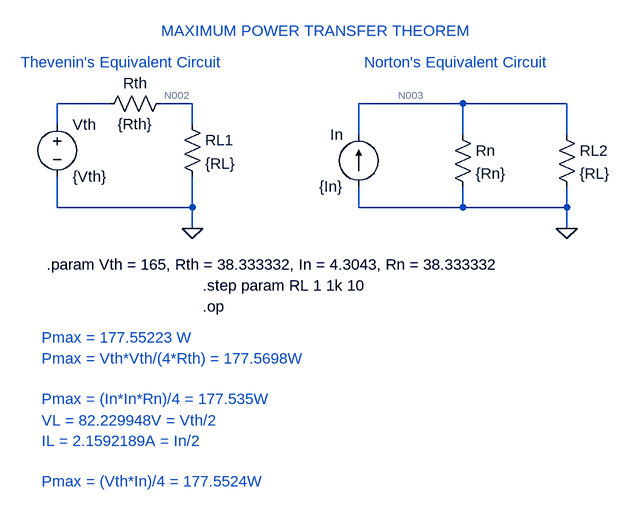
[diagram p0: schematic Maximum_Power_Transfer_Theorem_2.asc]
Maximum_Power_Transfer_Theorem_2.asc, the LTspice schematic file:
Version 4
SHEET 1 880 748
WIRE -16 64 -96 64
WIRE 112 64 64 64
WIRE 528 64 368 64
WIRE 688 64 528 64
WIRE -96 96 -96 64
WIRE 112 96 112 64
WIRE 368 112 368 64
WIRE 528 112 528 64
WIRE 688 112 688 64
WIRE -96 224 -96 176
WIRE 112 224 112 176
WIRE 112 224 -96 224
WIRE 368 224 368 192
WIRE 528 224 528 192
WIRE 528 224 368 224
WIRE 688 224 688 192
WIRE 688 224 528 224
WIRE 112 256 112 224
WIRE 688 256 688 224
FLAG 112 256 0
FLAG 688 256 0
SYMBOL voltage -96 80 R0
WINDOW 123 0 0 Left 0
WINDOW 39 0 0 Left 0
SYMATTR InstName Vth
SYMATTR Value {Vth}
SYMBOL res -32 80 R270
WINDOW 0 32 56 VTop 2
WINDOW 3 0 56 VBottom 2
SYMATTR InstName Rth
SYMATTR Value {Rth}
SYMBOL res 96 80 R0
SYMATTR InstName RL1
SYMATTR Value {RL}
SYMBOL current 368 192 R180
WINDOW 0 24 80 Left 2
WINDOW 3 24 0 Left 2
WINDOW 123 0 0 Left 0
WINDOW 39 0 0 Left 0
SYMATTR InstName In
SYMATTR Value {In}
SYMBOL res 512 96 R0
SYMATTR InstName Rn
SYMATTR Value {Rn}
SYMBOL res 672 96 R0
SYMATTR InstName RL2
SYMATTR Value {RL}
TEXT 64 -48 Left 2 ;MAXIMUM POWER TRANSFER THEOREM
TEXT -152 0 Left 2 ;Thevenin's Equivalent Circuit
TEXT 376 0 Left 2 ;Norton's Equivalent Circuit
TEXT -112 312 Left 2 !.param Vth = 165, Rth = 38.333332, In = 4.3043, Rn = 38.333332
TEXT 128 344 Left 2 !.step param RL 1 1k 10
TEXT 128 376 Left 2 !.op
TEXT -120 424 Left 2 ;Pmax = 177.55223 W
TEXT -120 456 Left 2 ;Pmax = Vth*Vth/(4*Rth) = 177.5698W\n \nPmax = (In*In*Rn)/4 = 177.535W
TEXT -120 552 Left 2 ;VL = 82.229948V = Vth/2\nIL = 2.1592189A = In/2\n \nPmax = (Vth*In)/4 = 177.5524W

The netlist it stands for:
* Maximum_Power_Transfer_Theorem_2.asc
Vth N001 0 {Vth}
Rth N001 N002 {Rth}
RL1 N002 0 {RL}
In 0 N003 {In}
Rn N003 0 {Rn}
RL2 N003 0 {RL}
* MAXIMUM POWER TRANSFER THEOREM
* Thevenin's Equivalent Circuit
* Norton's Equivalent Circuit
.param Vth = 165, Rth = 38.333332, In = 4.3043, Rn = 38.333332
.step param RL 1 1k 10
.op
* Pmax = 177.55223 W
* Pmax = Vth*Vth/(4*Rth) = 177.5698W
* Pmax = (In*In*Rn)/4 = 177.535W
* VL = 82.229948V = Vth/2
* IL = 2.1592189A = In/2
* Pmax = (Vth*In)/4 = 177.5524W
.backanno
.end

* Results of the author's LTspice run, read from the files saved beside the schematic
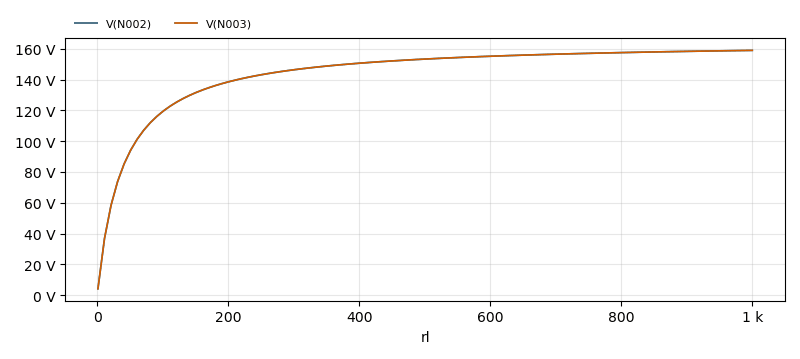
[diagram p1: Operating Point of Maximum_Power_Transfer_Theorem_2.asc, plotted from the saved traces]
* Operating Point, 1 run:
*   V(N002): 4.195 V at rl=1 , 158.9 V at rl=1 k, min 4.195 V, max 158.9 V
*   V(N003): 4.195 V at rl=1 , 158.9 V at rl=1 k, min 4.195 V, max 158.9 V